# EAGLE design 8085v13 (EAGLE 6.1)
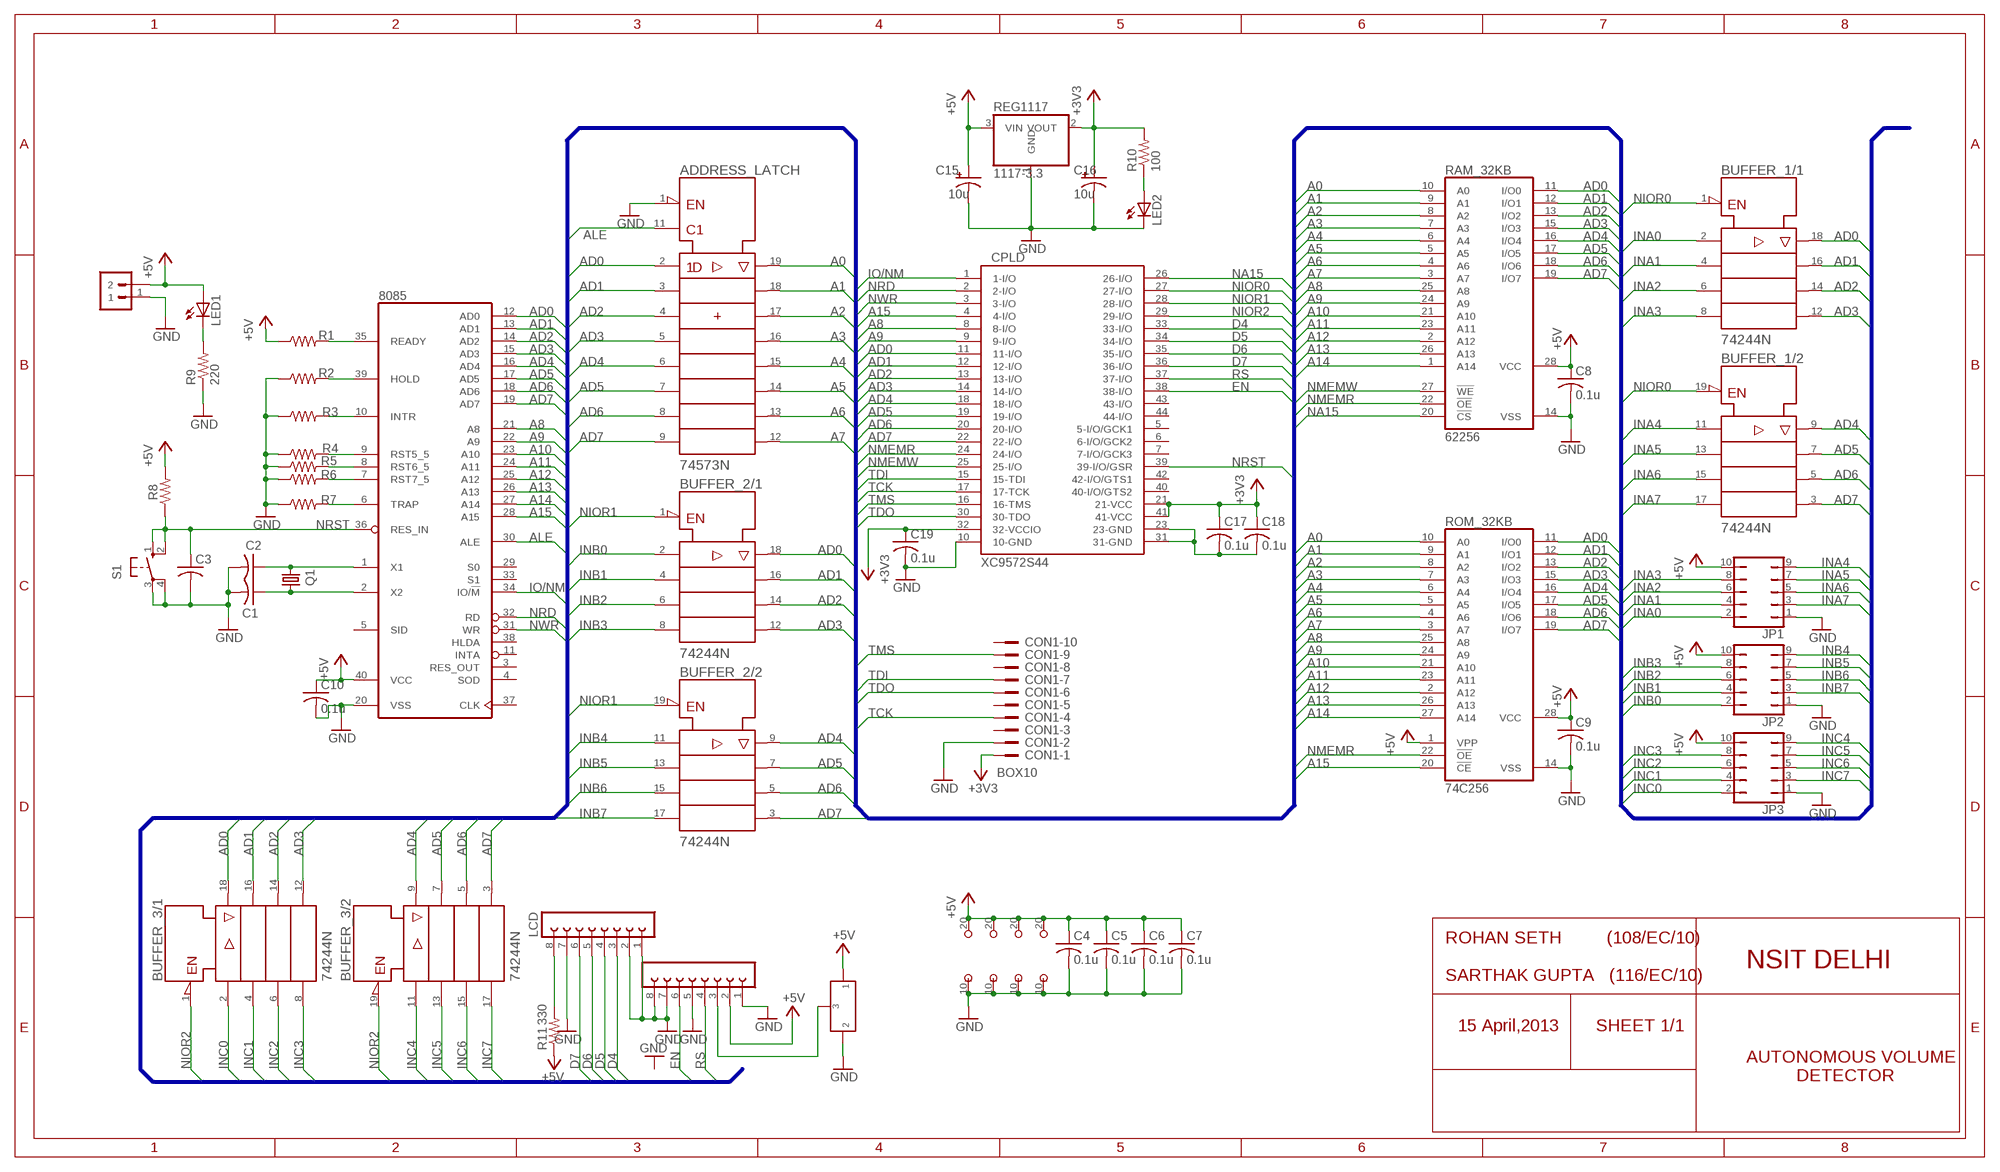
[diagram p0: schematic, sheet 1]

## Parts
1117-3.3  REG1117  [SOT223]
8085  8085  [DIL40]
ADDRESS_LATCH  74573N  [DIL20]
BUFFER_1  74244N  [DIL20]
BUFFER_2  74244N  [DIL20]
BUFFER_3  74244N  [DIL20]
C1  C-US025-030X050  [C025-030X050]
C2  C-US025-030X050  [C025-030X050]
C3  C-US025-030X050  [C025-030X050]
C4  0.1u  C-US025-030X050  [C025-030X050]
C5  0.1u  C-US025-030X050  [C025-030X050]
C6  0.1u  C-US025-030X050  [C025-030X050]
C7  0.1u  C-US025-030X050  [C025-030X050]
C8  0.1u  C-US025-030X050  [C025-030X050]
C9  0.1u  C-US025-030X050  [C025-030X050]
C10  0.1u  C-US025-030X050  [C025-030X050]
C15  10u  CPOL-USE2.5-5  [E2,5-5]
C16  10u  CPOL-USE2.5-5  [E2,5-5]
C17  0.1u  C-US025-030X050  [C025-030X050]
C18  0.1u  C-US025-030X050  [C025-030X050]
C19  0.1u  C-US025-030X050  [C025-030X050]
CON1  BOX10  [BOX10]
CPLD  XC9572S44  [PLCC-S44]
JP1  JP5Q  [JP5Q]
JP2  JP5Q  [JP5Q]
JP3  JP5Q  [JP5Q]
LCD  FE08-1  [FE08]
LED1  LED3MM  [LED3MM]
LED2  LED3MM  [LED3MM]
Q1  CRYSTALHC49US  [HC49US]
R1  R-US_0207/10  [0207/10]
R2  R-US_0207/10  [0207/10]
R3  R-US_0207/10  [0207/10]
R4  R-US_0207/10  [0207/10]
R5  R-US_0207/10  [0207/10]
R6  R-US_0207/10  [0207/10]
R7  R-US_0207/10  [0207/10]
R8  R-US_0207/10  [0207/10]
R9  220  RESISTOR0207/10  [0207/10]
R10  100  RESISTOR0207/10  [0207/10]
R11  330  R-US_0207/10  [0207/10]
RAM_32KB  62256  62256P  [DIL28-6]
ROM_32KB  74C256  27C256AG  [DIL28-6]
S1  10-XX  [B3F-10XX]
SV2  FE08-1  [FE08]
U$1  PRESET_LR  [PRESET_LR]
U$2  1X2_LR  [1X2_LR]

## Nets
+3V3 [power]: 1117-3.3.2(VOUT) C16.+ C17.1 C18.1 C19.1 CON1.1 CPLD.21(21-VCC) CPLD.32(32-VCCIO) CPLD.41(41-VCC) R10.2
+5V [power]: 1117-3.3.3(VIN) 8085.40(VCC) ADDRESS_LATCH.20(+UB) BUFFER_1.20(/+UB:+UB) BUFFER_2.20(/+UB:+UB) BUFFER_3.20(/+UB:+UB) C4.1 C5.1 C6.1 C7.1 C8.1 C9.1 C10.1 C15.+ JP1.10 JP2.10 JP3.10 LED1.A R1.1 R8.2 R11.1 RAM_32KB.28(VCC) ROM_32KB.1(VPP) ROM_32KB.28(VCC) SV2.2 U$1.P$1 U$2.2
A0: ADDRESS_LATCH.19(1Q) RAM_32KB.10(A0) ROM_32KB.10(A0)
A1: ADDRESS_LATCH.18(2Q) RAM_32KB.9(A1) ROM_32KB.9(A1)
A2: ADDRESS_LATCH.17(3Q) RAM_32KB.8(A2) ROM_32KB.8(A2)
A3: ADDRESS_LATCH.16(4Q) RAM_32KB.7(A3) ROM_32KB.7(A3)
A4: ADDRESS_LATCH.15(5Q) RAM_32KB.6(A4) ROM_32KB.6(A4)
A5: ADDRESS_LATCH.14(6Q) RAM_32KB.5(A5) ROM_32KB.5(A5)
A6: ADDRESS_LATCH.13(7Q) RAM_32KB.4(A6) ROM_32KB.4(A6)
A7 [smd]: ADDRESS_LATCH.12(8Q) RAM_32KB.3(A7) ROM_32KB.3(A7)
A8: 8085.21(A8) CPLD.8(8-I/O) RAM_32KB.25(A8) ROM_32KB.25(A8)
A9: 8085.22(A9) CPLD.9(9-I/O) RAM_32KB.24(A9) ROM_32KB.24(A9)
A10: 8085.23(A10) RAM_32KB.21(A10) ROM_32KB.21(A10)
A11: 8085.24(A11) RAM_32KB.23(A11) ROM_32KB.23(A11)
A12: 8085.25(A12) RAM_32KB.2(A12) ROM_32KB.2(A12)
A13: 8085.26(A13) RAM_32KB.26(A13) ROM_32KB.26(A13)
A14: 8085.27(A14) RAM_32KB.1(A14) ROM_32KB.27(A14)
A15 [smd]: 8085.28(A15) CPLD.4(4-I/O) ROM_32KB.20(!CE)
AD0 [smd]: 8085.12(AD0) ADDRESS_LATCH.2(1D) BUFFER_1.18(/1:Y1) BUFFER_2.18(/1:Y1) BUFFER_3.18(/1:Y1) CPLD.11(11-I/O) RAM_32KB.11(I/O0) ROM_32KB.11(I/O0)
AD1 [smd]: 8085.13(AD1) ADDRESS_LATCH.3(2D) BUFFER_1.16(/1:Y2) BUFFER_2.16(/1:Y2) BUFFER_3.16(/1:Y2) CPLD.12(12-I/O) RAM_32KB.12(I/O1) ROM_32KB.12(I/O1)
AD2: 8085.14(AD2) ADDRESS_LATCH.4(3D) BUFFER_1.14(/1:Y3) BUFFER_2.14(/1:Y3) BUFFER_3.14(/1:Y3) CPLD.13(13-I/O) RAM_32KB.13(I/O2) ROM_32KB.13(I/O2)
AD3 [smd]: 8085.15(AD3) ADDRESS_LATCH.5(4D) BUFFER_1.12(/1:Y4) BUFFER_2.12(/1:Y4) BUFFER_3.12(/1:Y4) CPLD.14(14-I/O) RAM_32KB.15(I/O3) ROM_32KB.15(I/O3)
AD4: 8085.16(AD4) ADDRESS_LATCH.6(5D) BUFFER_1.9(/2:Y1) BUFFER_2.9(/2:Y1) BUFFER_3.9(/2:Y1) CPLD.18(18-I/O) RAM_32KB.16(I/O4) ROM_32KB.16(I/O4)
AD5: 8085.17(AD5) ADDRESS_LATCH.7(6D) BUFFER_1.7(/2:Y2) BUFFER_2.7(/2:Y2) BUFFER_3.7(/2:Y2) CPLD.19(19-I/O) RAM_32KB.17(I/O5) ROM_32KB.17(I/O5)
AD6: 8085.18(AD6) ADDRESS_LATCH.8(7D) BUFFER_1.5(/2:Y3) BUFFER_2.5(/2:Y3) BUFFER_3.5(/2:Y3) CPLD.20(20-I/O) RAM_32KB.18(I/O6) ROM_32KB.18(I/O6)
AD7: 8085.19(AD7) ADDRESS_LATCH.9(8D) BUFFER_1.3(/2:Y4) BUFFER_2.3(/2:Y4) BUFFER_3.3(/2:Y4) CPLD.22(22-I/O) RAM_32KB.19(I/O7) ROM_32KB.19(I/O7)
ALE: 8085.30(ALE) ADDRESS_LATCH.11(C)
D4: CPLD.33(33-I/O) LCD.3
D5 [smd]: CPLD.34(34-I/O) LCD.4
D6: CPLD.35(35-I/O) LCD.5
D7 [smd]: CPLD.36(36-I/O) LCD.6
EN [smd]: CPLD.38(38-I/O) SV2.6
GND [power]: 1117-3.3.1(GND) 8085.20(VSS) ADDRESS_LATCH.1(!OC) ADDRESS_LATCH.10(-UB) BUFFER_1.10(/-UB:-UB) BUFFER_2.10(/-UB:-UB) BUFFER_3.10(/-UB:-UB) C1.2 C2.2 C3.2 C4.2 C5.2 C6.2 C7.2 C8.2 C9.2 C10.2 C15.- C16.- C19.2 CON1.2 CPLD.10(10-GND) JP1.1 JP2.1 JP3.1 LCD.1 LCD.2 LCD.7 LED2.K(C) R2.1 R3.1 R4.1 R5.1 R6.1 R7.1 R9.1 RAM_32KB.14(VSS) ROM_32KB.14(VSS) S1.3(P) S1.4(P1) SV2.1 SV2.5 SV2.7 SV2.8 U$1.P$2 U$2.1
INA0: BUFFER_1.2(/1:A1) JP1.2
INA1: BUFFER_1.4(/1:A2) JP1.4
INA2: BUFFER_1.6(/1:A3) JP1.6
INA3: BUFFER_1.8(/1:A4) JP1.8
INA4: BUFFER_1.11(/2:A1) JP1.9
INA5: BUFFER_1.13(/2:A2) JP1.7
INA6: BUFFER_1.15(/2:A3) JP1.5
INA7: BUFFER_1.17(/2:A4) JP1.3
INB0 [smd]: BUFFER_2.2(/1:A1) JP2.2
INB1: BUFFER_2.4(/1:A2) JP2.4
INB2: BUFFER_2.6(/1:A3) JP2.6
INB3: BUFFER_2.8(/1:A4) JP2.8
INB4 [smd]: BUFFER_2.11(/2:A1) JP2.9
INB5: BUFFER_2.13(/2:A2) JP2.7
INB6 [smd]: BUFFER_2.15(/2:A3) JP2.5
INB7 [smd]: BUFFER_2.17(/2:A4) JP2.3
INC0: BUFFER_3.2(/1:A1) JP3.2
INC1: BUFFER_3.4(/1:A2) JP3.4
INC2: BUFFER_3.6(/1:A3) JP3.6
INC3: BUFFER_3.8(/1:A4) JP3.8
INC4: BUFFER_3.11(/2:A1) JP3.9
INC5: BUFFER_3.13(/2:A2) JP3.7
INC6: BUFFER_3.15(/2:A3) JP3.5
INC7: BUFFER_3.17(/2:A4) JP3.3
IO/NM [smd]: 8085.34(IO/!M) CPLD.1(1-I/O)
N$1: 8085.1(X1) C2.1 Q1.2
N$2: 8085.2(X2) C1.1 Q1.1
N$3: 8085.35(READY) R1.2
N$4: 8085.39(HOLD) R2.2
N$5: 8085.10(INTR) R3.2
N$6: 8085.9(RST5_5) R4.2
N$7: 8085.8(RST6_5) R5.2
N$8: 8085.7(RST7_5) R6.2
N$9: 8085.6(TRAP) R7.2
N$12 [smd]: C17.2 C18.2 CPLD.23(23-GND) CPLD.31(31-GND)
N$15: LCD.8 R11.2
N$46: LED1.K(C) R9.2
N$47: SV2.3 U$1.P$3
N$51: LED2.A R10.1
NA15: CPLD.26(26-I/O) RAM_32KB.20(!CS)
NIOR0 [smd]: BUFFER_1.1(/1:!G) BUFFER_1.19(/2:!G) CPLD.27(27-I/O)
NIOR1 [smd]: BUFFER_2.1(/1:!G) BUFFER_2.19(/2:!G) CPLD.28(28-I/O)
NIOR2: BUFFER_3.1(/1:!G) BUFFER_3.19(/2:!G) CPLD.29(29-I/O)
NMEMR [smd]: CPLD.24(24-I/O) RAM_32KB.22(!OE) ROM_32KB.22(!OE)
NMEMW [smd]: CPLD.25(25-I/O) RAM_32KB.27(!WE)
NRD [smd]: 8085.32(RD) CPLD.2(2-I/O)
NRST: 8085.36(RES_IN) C3.1 CPLD.39(39-I/O/GSR) R8.1 S1.1(S) S1.2(S1)
NWR: 8085.31(WR) CPLD.3(3-I/O)
RS [smd]: CPLD.37(37-I/O) SV2.4
TCK: CON1.4 CPLD.17(17-TCK)
TDI: CON1.7 CPLD.15(15-TDI)
TDO [smd]: CON1.6 CPLD.30(30-TDO)
TMS [smd]: CON1.9 CPLD.16(16-TMS)
Unconnected: 8085.3(RES_OUT) 8085.4(SOD) 8085.5(SID) 8085.11(INTA) 8085.29(S0) 8085.33(S1) 8085.37(CLK) 8085.38(HLDA) CON1.3 CON1.5 CON1.8 CON1.10 CPLD.5(5-I/O/GCK1) CPLD.6(6-I/O/GCK2) CPLD.7(7-I/O/GCK3) CPLD.40(40-I/O/GTS2) CPLD.42(42-I/O/GTS1) CPLD.43(43-I/O) CPLD.44(44-I/O)

## Buses
AD[0..7],A[8..15],A[0..7],ALE,IO/NM,NRD,NWR,NMEMR,NMEMW,NIOR,NIOW,D[4..7],RS,EN,NIOR[0..2],NA15,TDI,TMS,TCK,TDO,INA[0..7],INB[0..7],INC[0..7],NRST

## Notes on the sheet
- NSIT DELHI
- ROHAN SETH         (108/EC/10)
  
  SARTHAK GUPTA   (116/EC/10)
- 15 April,2013 | SHEET 1/1
- AUTONOMOUS VOLUME
            DETECTOR

## Library data of the parts
1117-3.3 = CEDTv69:REG1117: 800mA and 1A Low Dropout (LDO) Positive Regulator 1.8V, 2.5V, 2.85V, 3.3V, 5V, and Adj
8085 = micro-intel:8085: MICROCOMPUTER/PERIPHERAL DEVICE
ADDRESS_LATCH = 74ttl-din:74*573: 8-bit D latch BUS DRIVER
BUFFER_1-BUFFER_3 = 74ttl-din:74*244: Octal BUFFER and LINE DRIVER, 3-state
C1-C10 C17-C19 = resistor:C-US: CAPACITOR, American symbol
C15 C16 = resistor:CPOL-US: POLARIZED CAPACITOR, American symbol
CON1 = CEDTv73:BOX10: 3M (TM) Pak 100 4-Wall Header Source: 3M
CPLD = CEDTv68:XC9572
JP1-JP3 = jumper:JP5Q: JUMPER
LCD SV2 = con-lsta:FE08-1: FEMALE HEADER; OC_FARNELL: unknown; OC_NEWARK: unknown
LED1 LED2 = CEDTv73:LED
Q1 = CEDTv69:CRYSTAL: Crystals Various standard crystals. Proven footprints. Spark Fun Electronics SKU : COM-00534
R1-R8 = resistor:R-US_: RESISTOR, American symbol
R9 R10 = CEDTv73:RESISTOR
R11 = rcl:R-US_: RESISTOR, American symbol
RAM_32KB = memory-hitachi:62256P: MEMORY
ROM_32KB = memory-hitachi:27C256AG: MEMORY
S1 = CEDTv69:10-XX: OMRON SWITCH
U$1 = CEDTv69:PRESET_LR
U$2 = CEDTv73:1X2_LR

## Net classes
0 default: width 0.305 mm, clearance 0.203 mm
1 power: width 0.61 mm, clearance 0.203 mm
2 smd: width 0.254 mm, clearance 0.203 mm

## Board
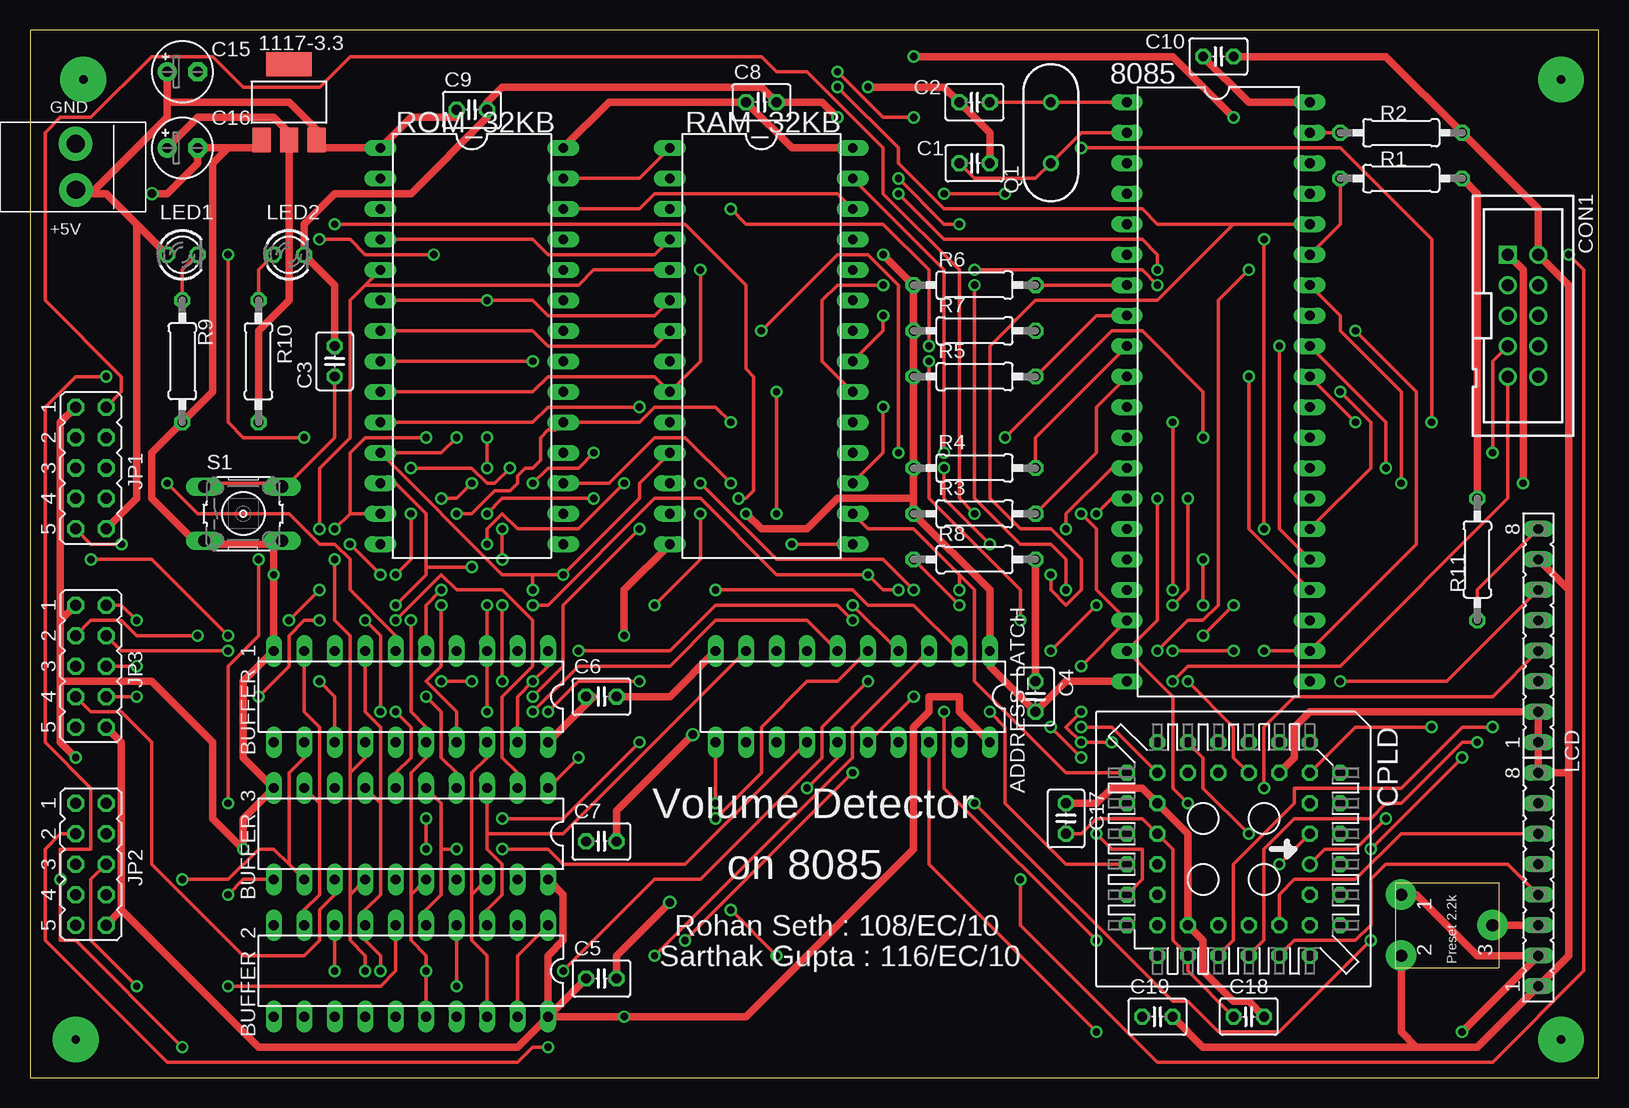
[diagram p1: board, top side]
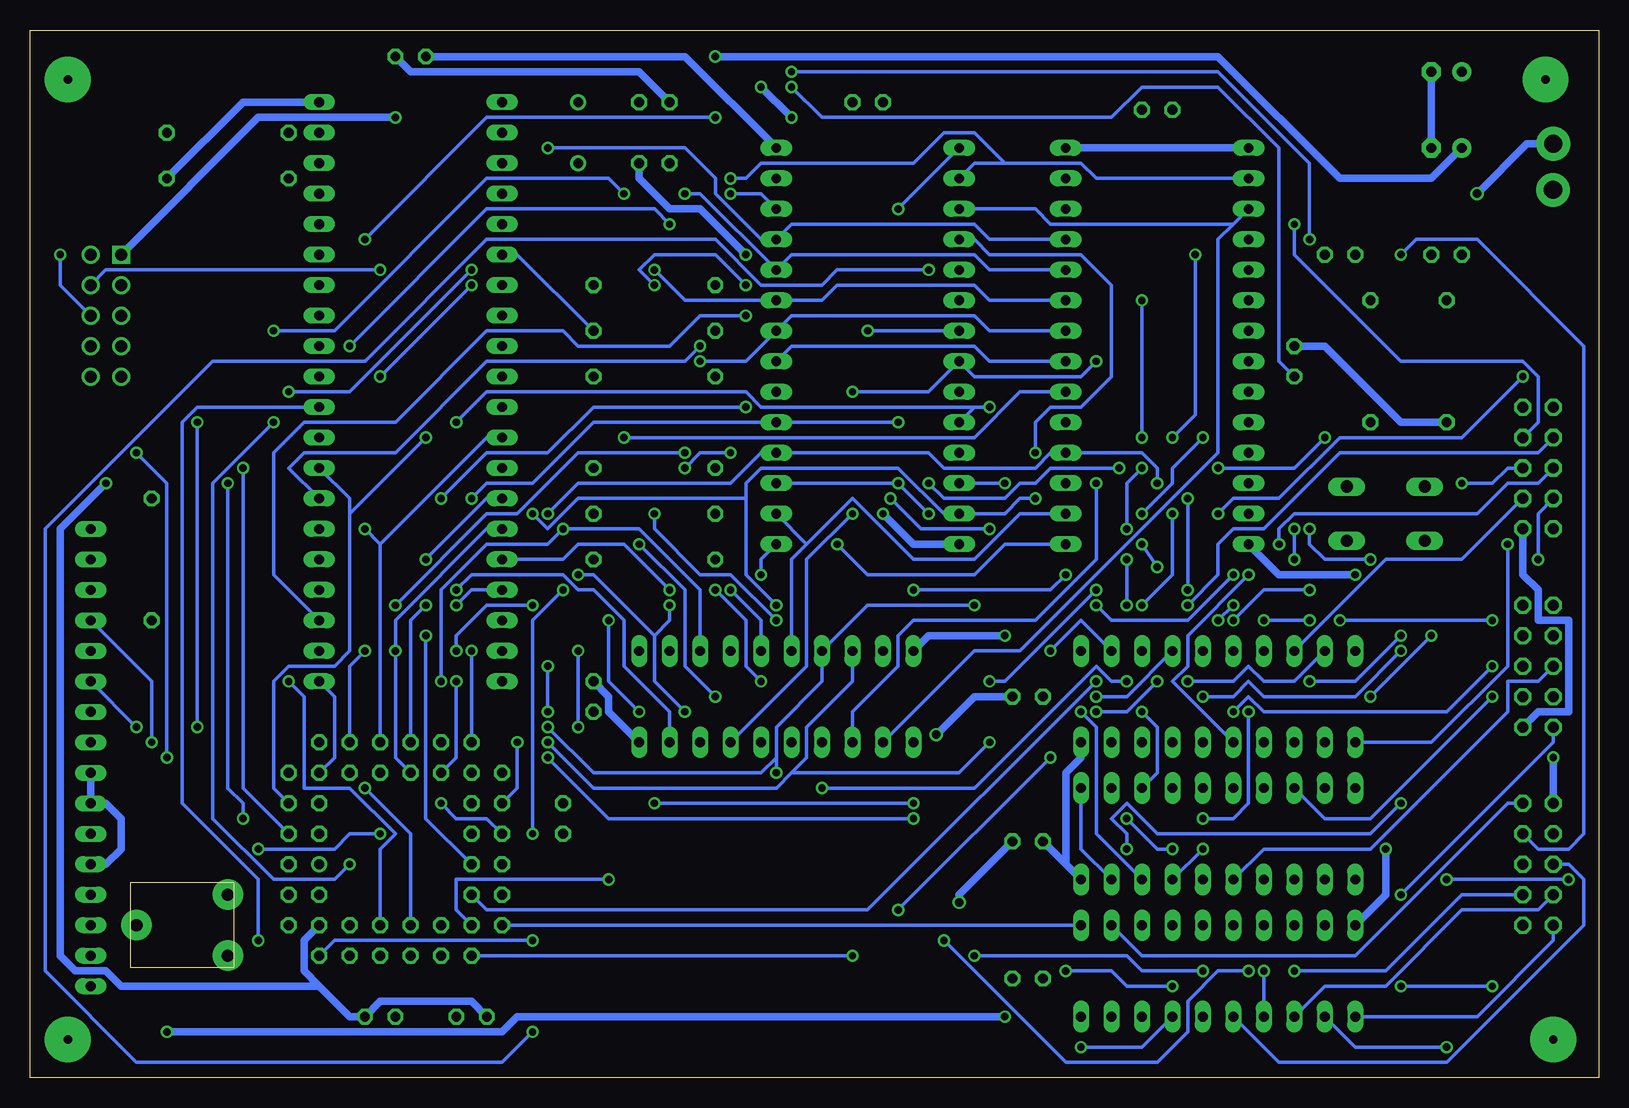
[diagram p2: board, bottom side, seen from below]

Size 130.79 x 87.3 mm. Coordinates in mm from the lower left corner, seen from the top.
Outline: 0,0 130.79,0 130.79,87.3 0,87.3 0,0
Copper layers (1*16): Top 0.035mm / dielectric 1.5mm / Bottom 0.035mm
Design rules: minimum track width 12mil, minimum drill 24mil, track to track 8mil, track to pad 8mil, pad to pad 8mil, via to via 8mil, smd to smd 8mil, copper to edge 40mil, drill to drill 8mil, minimum pad ring 10mil, minimum via ring 8mil, stop-mask expansion 4mil, vias tented up to drill 0mil, thermal gap 10mil

### Footprints (pad centres in the part's own frame; a part is rotated, then mirrored left to right if it is on the bottom)
SOT223 = smd 1.499 x 2.007: 1 -2.261,-3.15; 2 0.025,-3.15; 3 2.311,-3.15 | smd 3.81 x 2.007: 4 0,3.15
DIL40 = drill 0.813 long: 1 -24.13,-7.62; 2 -21.59,-7.62; 3 -19.05,-7.62; 4 -16.51,-7.62; 5 -13.97,-7.62; 6 -11.43,-7.62; 7 -8.89,-7.62; 8 -6.35,-7.62; 9 -3.81,-7.62; 10 -1.27,-7.62; 11 1.27,-7.62; 12 3.81,-7.62; 13 6.35,-7.62; 14 8.89,-7.62; 15 11.43,-7.62; 16 13.97,-7.62; 17 16.51,-7.62; 18 19.05,-7.62; 19 21.59,-7.62; 20 24.13,-7.62; 21 24.13,7.62; 22 21.59,7.62; 23 19.05,7.62; 24 16.51,7.62; 25 13.97,7.62; 26 11.43,7.62; 27 8.89,7.62; 28 6.35,7.62; 29 3.81,7.62; 30 1.27,7.62; 31 -1.27,7.62; 32 -3.81,7.62; 33 -6.35,7.62; 34 -8.89,7.62; 35 -11.43,7.62; 36 -13.97,7.62; 37 -16.51,7.62; 38 -19.05,7.62; 39 -21.59,7.62; 40 -24.13,7.62
DIL20 = drill 0.813 long: 1 -11.43,-3.81; 2 -8.89,-3.81; 3 -6.35,-3.81; 4 -3.81,-3.81; 5 -1.27,-3.81; 6 1.27,-3.81; 7 3.81,-3.81; 8 6.35,-3.81; 9 8.89,-3.81; 10 11.43,-3.81; 11 11.43,3.81; 12 8.89,3.81; 13 6.35,3.81; 14 3.81,3.81; 15 1.27,3.81; 16 -1.27,3.81; 17 -3.81,3.81; 18 -6.35,3.81; 19 -8.89,3.81; 20 -11.43,3.81
C025-030X050 = drill 0.813 octagon: 1 -1.27,0; 2 1.27,0
E2,5-5 = drill 0.813 pad 1.6: + -1.27,0 | drill 0.813 pad 1.6 octagon: - 1.27,0
BOX10 = drill 1 pad 1.422 square: 1 -5.08,-1.27 | drill 1 pad 1.422: 2 -5.08,1.27; 3 -2.54,-1.27; 4 -2.54,1.27; 5 0,-1.27; 6 0,1.27; 7 2.54,-1.27; 8 2.54,1.27; 9 5.08,-1.27; 10 5.08,1.27
PLCC-S44 = drill 0.813: 1 1.27,6.35 | drill 0.813 octagon: 2 -1.27,8.89; 3 -1.27,6.35; 4 -3.81,8.89; 5 -3.81,6.35; 6 -6.35,8.89; 7 -8.89,6.35; 8 -6.35,6.35; 9 -8.89,3.81; 10 -6.35,3.81; 11 -8.89,1.27; 12 -6.35,1.27; 13 -8.89,-1.27; 14 -6.35,-1.27; 15 -8.89,-3.81; 16 -6.35,-3.81; 17 -8.89,-6.35; 18 -6.35,-8.89; 19 -6.35,-6.35; 20 -3.81,-8.89; 21 -3.81,-6.35; 22 -1.27,-8.89; 23 -1.27,-6.35; 24 1.27,-8.89; 25 1.27,-6.35; 26 3.81,-8.89; 27 3.81,-6.35; 28 6.35,-8.89; 29 8.89,-6.35; 30 6.35,-6.35; 31 8.89,-3.81; 32 6.35,-3.81; 33 8.89,-1.27; 34 6.35,-1.27; 35 8.89,1.27; 36 6.35,1.27; 37 8.89,3.81; 38 6.35,3.81; 39 8.89,6.35; 40 6.35,8.89; 41 6.35,6.35; 42 3.81,8.89; 43 3.81,6.35; 44 1.27,8.89
JP5Q = drill 0.914 octagon: 1 -5.08,-1.27; 2 -5.08,1.27; 3 -2.54,-1.27; 4 -2.54,1.27; 5 0,-1.27; 6 0,1.27; 7 2.54,-1.27; 8 2.54,1.27; 9 5.08,-1.27; 10 5.08,1.27
FE08 = drill 0.813 long: 1 -8.89,0; 2 -6.35,0; 3 -3.81,0; 4 -1.27,0; 5 1.27,0; 6 3.81,0; 7 6.35,0; 8 8.89,0
LED3MM = drill 0.813 octagon: A -1.27,0; K 1.27,0
HC49US = drill 0.813: 1 -2.54,0; 2 2.54,0
0207/10 = drill 0.813 octagon: 1 -5.08,0; 2 5.08,0
DIL28-6 = drill 0.813 long: 1 -16.51,-7.62; 2 -13.97,-7.62; 3 -11.43,-7.62; 4 -8.89,-7.62; 5 -6.35,-7.62; 6 -3.81,-7.62; 7 -1.27,-7.62; 8 1.27,-7.62; 9 3.81,-7.62; 10 6.35,-7.62; 11 8.89,-7.62; 12 11.43,-7.62; 13 13.97,-7.62; 14 16.51,-7.62; 15 16.51,7.62; 16 13.97,7.62; 17 11.43,7.62; 18 8.89,7.62; 19 6.35,7.62; 20 3.81,7.62; 21 1.27,7.62; 22 -1.27,7.62; 23 -3.81,7.62; 24 -6.35,7.62; 25 -8.89,7.62; 26 -11.43,7.62; 27 -13.97,7.62; 28 -16.51,7.62
B3F-10XX = drill 1.016 long: 1 -3.251,2.261; 2 3.251,2.261; 3 -3.251,-2.261; 4 3.251,-2.261
PRESET_LR = drill 1.016 pad 2.54: P$1 -2.54,-3.81; P$2 2.54,-3.81; P$3 0,3.81
1X2_LR = drill 1.524 pad 2.794: 1 -1.621,3.81; 2 2.218,3.83; 3 -1.621,3.81

### Placement (x,y rotation side)
1117-3.3  21.59,81.28 0 top
8085  99.06,57.15 270 top
ADDRESS_LATCH  68.58,31.75 180 top
BUFFER_1  31.75,31.75 180 top
BUFFER_2  31.75,8.89 180 top
BUFFER_3  31.75,20.32 180 top
C1  78.74,76.2 0 top
C2  78.74,81.28 180 top
C3  25.4,59.69 90 top
C4  83.82,31.75 270 top
C5  47.62,8.26 0 top
C6  47.62,31.75 0 top
C7  47.62,19.68 0 top
C8  60.96,81.28 0 top
C9  36.83,80.64 0 top
C10  99.06,85.09 0 top
C15  12.7,83.82 0 top
C16  12.7,77.47 0 top
C17  86.36,21.59 270 top
C18  101.6,5.08 180 top
C19  93.98,5.08 0 top
CON1  124.46,63.5 270 top
CPLD  100.33,19.05 270 top
JP1  5.08,50.8 270 top
JP2  5.08,17.78 270 top
JP3  5.08,34.29 270 top
LCD  125.73,36.83 90 top
LED1  12.7,68.58 0 top
LED2  21.59,68.58 0 top
Q1  85.09,78.74 90 top
R1  114.3,74.93 180 top
R2  114.3,78.74 180 top
R3  78.74,46.99 0 top
R4  78.74,50.8 0 top
R5  78.74,58.42 0 top
R6  78.74,66.04 0 top
R7  78.74,62.23 0 top
R8  78.74,43.18 0 top
R9  12.7,59.69 90 top
R10  19.05,59.69 270 top
R11  120.65,43.18 270 top
RAM_32KB  60.96,60.96 270 top
ROM_32KB  36.83,60.96 270 top
S1  17.78,46.99 0 top
SV2  125.73,16.51 90 top
U$1  118.11,12.7 270 top
U$2  0,76.2 270 top

### Tracks (layer width: path | path; a pad name or v marks a point on that pad's centre or on a via)
+3V3  (via drill 0.61)
  Top 0.61: C16.+ 13.97,80.01 20.32,80.01 21.59,78.74 1117-3.3.2 21.59,77.47 21.59,64.77 19.05,62.23 R10.2 | C17.1 88.9,22.86 90.17,24.13 92.71,24.13 CPLD.21 96.52,20.32 CPLD.32 97.79,11.43 97.79,8.89 100.33,6.35 101.6,6.35 C18.1 | CON1.1 124.46,67.31 v124.46,49.53 | v73.66,85.09 95.25,85.09 v100.33,80.01
  Bottom 0.61: C19.1 93.98,6.35 101.6,6.35 C18.1 104.14,5.08 106.68,7.62 | CPLD.41 107.95,11.43 107.95,8.89 106.68,7.62 | v124.46,49.53 128.27,45.72 128.27,10.16 127,8.89 124.46,8.89 123.19,7.62 106.68,7.62 | C16.+ 13.97,74.93 21.59,74.93 31.75,85.09 v73.66,85.09 | v100.33,80.01 111.76,80.01 CON1.1
+5V  (via drill 0.61)
  Top 0.61: C4.1 R8.2 | 7.62,13.97 JP2.10 | 7.62,13.97 7.62,27.94 JP3.10 | BUFFER_1.20 46.99,31.75 C6.1 | BUFFER_2.20 43.18,10.16 44.45,11.43 44.45,15.24 BUFFER_3.20 | v119.38,3.81 SV2.2 120.65,10.16 115.57,15.24 U$1.P$1 | BUFFER_2.20 v49.53,5.08 59.69,5.08 73.66,19.05 73.66,29.21 74.93,30.48 74.93,31.75 77.47,31.75 77.47,30.48 ADDRESS_LATCH.20 | 7.62,13.97 19.05,2.54 40.64,2.54 BUFFER_2.20 | 8085.40 101.6,81.28 C10.1 | R11.1 120.65,73.66 R1.1 | RAM_32KB.28 63.5,77.47 C8.1 48.26,81.28 ROM_32KB.28 | C9.1 35.56,80.01 31.75,80.01 ROM_32KB.1 24.13,77.47 1117-3.3.3 24.13,78.74 21.59,81.28 11.43,81.28 | 8.89,71.12 6.35,73.66 5.08,73.66 | 8.89,71.12 LED1.A | JP1.10 8.89,48.26 8.89,71.12 | 11.43,81.28 11.43,80.01 5.08,73.66 | 11.43,81.28 C15.+ | 5.08,73.66 U$2.2 | C5.1 BUFFER_2.20
  Bottom 0.61: ADDRESS_LATCH.20 82.55,30.48 82.55,31.75 C4.1 | v119.38,3.81 91.44,3.81 90.17,5.08 v49.53,5.08 | BUFFER_1.20 43.18,26.67 44.45,25.4 44.45,17.78 | BUFFER_3.20 44.45,17.78 | R1.1 113.03,81.28 8085.40 | ROM_32KB.1 ROM_32KB.28 | C10.1 76.2,85.09 RAM_32KB.28 | JP3.10 5.08,30.48 2.54,30.48 2.54,38.1 5.08,38.1 5.08,40.64 6.35,41.91 JP1.10 | C7.1 44.45,17.78
A0  (via drill 0.61)
  Top 0.305: ROM_32KB.10 41.91,54.61 43.18,55.88 v50.8,55.88 | v95.25,54.61 v95.25,40.64
  Bottom 0.305: 52.07,55.88 v50.8,55.88 | RAM_32KB.10 52.07,55.88 | ADDRESS_LATCH.19 77.47,30.48 81.28,34.29 81.28,38.1 83.82,40.64 85.09,40.64 86.36,41.91 93.98,41.91 v95.25,40.64 | v95.25,54.61 92.71,57.15 71.12,57.15 69.85,55.88 52.07,55.88
A1  (via drill 0.61)
  Top 0.305: ROM_32KB.9 41.91,57.15 43.18,58.42 52.07,58.42 RAM_32KB.9 55.88,59.69 v55.88,67.31 | ADDRESS_LATCH.18 74.93,17.78 v88.9,3.81
  Bottom 0.305: v88.9,3.81 91.44,1.27 121.92,1.27 129.54,8.89 129.54,45.72 115.57,59.69 102.87,59.69 92.71,69.85 73.66,69.85 69.85,66.04 64.77,66.04 63.5,67.31 v55.88,67.31
A2  (via drill 0.61)
  Top 0.305: v41.91,59.69 ROM_32KB.8 | v62.23,57.15 v62.23,46.99
  Bottom 0.305: v41.91,59.69 43.18,58.42 52.07,58.42 RAM_32KB.8 55.88,57.15 v62.23,57.15 | ADDRESS_LATCH.17 66.04,34.29 66.04,43.18 v62.23,46.99
A3  (via drill 0.61)
  Top 0.305: ROM_32KB.7 41.91,62.23 43.18,60.96 52.07,60.96 RAM_32KB.7 | v73.66,31.75 ADDRESS_LATCH.16 | v80.01,44.45 76.2,48.26 v76.2,50.8 | v72.39,52.07 72.39,66.04 69.85,68.58 67.31,68.58 v60.96,62.23
  Bottom 0.305: v73.66,31.75 76.2,34.29 76.2,40.64 v80.01,44.45 | v76.2,50.8 74.93,52.07 v72.39,52.07 | RAM_32KB.7 v60.96,62.23
A4  (via drill 0.61)
  Top 0.305: ROM_32KB.6 v38.1,64.77 41.91,64.77 43.18,63.5 52.07,63.5 RAM_32KB.6 | ADDRESS_LATCH.15 67.31,26.67 v64.77,24.13 | v39.37,39.37 v39.37,33.02 | v39.37,45.72 v39.37,43.18 | v38.1,53.34 v38.1,50.8
  Bottom 0.305: v64.77,24.13 52.07,24.13 41.91,34.29 40.64,33.02 v39.37,33.02 | v39.37,43.18 v39.37,39.37 | v39.37,45.72 39.37,49.53 v38.1,50.8 | v38.1,64.77 v38.1,53.34
A5  (via drill 0.61)
  Top 0.305: ADDRESS_LATCH.14 54.61,17.78 44.45,17.78 43.18,19.05 v39.37,19.05 | v16.51,22.86 16.51,34.29 19.05,36.83 v19.05,43.18 | v24.13,45.72 24.13,50.8 26.67,53.34 26.67,64.77 27.94,66.04 | ROM_32KB.5 27.94,66.04 | RAM_32KB.5 46.99,67.31 45.72,66.04 27.94,66.04
  Bottom 0.305: v39.37,19.05 39.37,20.32 40.64,21.59 39.37,22.86 36.83,20.32 19.05,20.32 v16.51,22.86 | v19.05,43.18 22.86,43.18 24.13,44.45 v24.13,45.72
A6  (via drill 0.61)
  Top 0.305: ROM_32KB.4 41.91,69.85 43.18,68.58 52.07,68.58 RAM_32KB.4 | v41.91,49.53 43.18,50.8 45.72,50.8 v46.99,52.07
  Bottom 0.305: ADDRESS_LATCH.13 62.23,30.48 58.42,34.29 58.42,36.83 57.15,38.1 46.99,38.1 41.91,43.18 v41.91,49.53 | v46.99,52.07 46.99,54.61 45.72,55.88 43.18,55.88 40.64,58.42 40.64,66.04 43.18,68.58 50.8,68.58 52.07,69.85 RAM_32KB.4
A7
  Bottom 0.305: ADDRESS_LATCH.12 52.07,35.56 48.26,35.56 31.75,52.07 31.75,69.85 30.48,71.12 | ROM_32KB.3 30.48,71.12 | RAM_32KB.3 46.99,72.39 45.72,71.12 30.48,71.12
A8  (via drill 0.61)
  Top 0.305: CPLD.8 110.49,29.21 v116.84,29.21 | v116.84,54.61 116.84,69.85 109.22,77.47 v87.63,77.47
  Bottom 0.305: CPLD.8 105.41,26.67 105.41,31.75 8085.21 | ROM_32KB.25 50.8,69.85 52.07,71.12 67.31,71.12 RAM_32KB.25 69.85,69.85 73.66,73.66 73.66,74.93 76.2,77.47 v87.63,77.47 | v116.84,54.61 v116.84,29.21
A9  (via drill 0.61)
  Top 0.305: v102.87,35.56 8085.22 115.57,44.45 115.57,57.15 v110.49,62.23 | v76.2,73.66 v81.28,73.66
  Bottom 0.305: CPLD.9 104.14,34.29 v102.87,35.56 | ROM_32KB.24 50.8,67.31 52.07,68.58 67.31,68.58 RAM_32KB.24 74.93,73.66 v76.2,73.66 | v110.49,62.23 105.41,62.23 92.71,74.93 82.55,74.93 v81.28,73.66
A10  (via drill 0.61)
  Top 0.305: v71.12,63.5 71.12,62.23 RAM_32KB.21
  Bottom 0.305: ROM_32KB.21 50.8,59.69 52.07,60.96 67.31,60.96 RAM_32KB.21 | 8085.23 110.49,41.91 110.49,52.07 107.95,54.61 100.33,54.61 92.71,62.23 86.36,62.23 85.09,60.96 77.47,60.96 74.93,63.5 v71.12,63.5
A11  (via drill 0.61)
  Top 0.305: 8085.24 101.6,45.72 v101.6,58.42 | v93.98,66.04 92.71,67.31 v78.74,67.31
  Bottom 0.305: ROM_32KB.23 50.8,64.77 52.07,66.04 63.5,66.04 64.77,64.77 RAM_32KB.23 76.2,64.77 v78.74,67.31 | v93.98,66.04 v101.6,58.42
A12  (via drill 0.61)
  Top 0.305: 8085.25 104.14,45.72 v104.14,60.96 | v77.47,71.12 76.2,71.12 v72.39,74.93
  Bottom 0.305: ROM_32KB.2 41.91,74.93 43.18,76.2 49.53,76.2 | 49.53,76.2 52.07,76.2 RAM_32KB.2 | v104.14,60.96 92.71,72.39 78.74,72.39 v77.47,71.12 | v72.39,74.93 71.12,74.93 69.85,76.2 57.15,76.2 54.61,78.74 52.07,78.74 49.53,76.2
A13  (via drill 0.61)
  Top 0.305: ROM_32KB.26 50.8,72.39 52.07,73.66 67.31,73.66 RAM_32KB.26 | 8085.26 111.76,50.8 111.76,54.61 v109.22,57.15 | v93.98,67.31 93.98,68.58 92.71,69.85 76.2,69.85 v72.39,73.66
  Bottom 0.305: v109.22,57.15 104.14,57.15 v93.98,67.31 | v72.39,73.66 69.85,73.66 RAM_32KB.26
A14  (via drill 0.61)
  Top 0.305: ROM_32KB.27 50.8,74.93 RAM_32KB.1 | v74.93,60.96 74.93,67.31 71.12,71.12 59.69,71.12 v58.42,72.39
  Bottom 0.305: 8085.27 109.22,50.8 107.95,52.07 100.33,52.07 92.71,59.69 76.2,59.69 v74.93,60.96 | RAM_32KB.1 v58.42,72.39
A15  (via drill 0.61)
  Top 0.305: v81.28,53.34 90.17,62.23 92.71,62.23 97.79,57.15 v97.79,53.34
  Bottom 0.305: 8085.28 104.14,48.26 104.14,46.99 | 104.14,46.99 104.14,35.56 105.41,34.29 109.22,34.29 110.49,33.02 110.49,24.13 CPLD.4 | ROM_32KB.20 48.26,57.15 52.07,53.34 v81.28,53.34 | 104.14,46.99 v97.79,53.34
AD0  (via drill 0.61)
  Top 0.305: BUFFER_2.18 38.1,10.16 36.83,11.43 36.83,15.24 | BUFFER_3.18 36.83,15.24 | BUFFER_1.18 38.1,26.67 36.83,25.4 36.83,15.24 | 41.91,41.91 v44.45,41.91 50.8,48.26 50.8,49.53 RAM_32KB.11 | 41.91,41.91 39.37,41.91 ROM_32KB.11 34.29,52.07 v35.56,53.34 | ADDRESS_LATCH.2 73.66,39.37 69.85,39.37 68.58,40.64 v57.15,40.64 | v43.18,30.48 45.72,33.02 v50.8,33.02 | 41.91,41.91 v41.91,40.64 | v102.87,69.85 v102.87,45.72 | v73.66,80.01 71.12,80.01 v67.31,83.82 | v24.13,69.85 26.67,69.85 27.94,68.58 v33.66,68.58
  Bottom 0.305: 101.6,44.45 CPLD.11 | 101.6,44.45 92.71,53.34 8085.12 | v57.15,40.64 45.72,40.64 v44.45,41.91 | BUFFER_3.18 41.91,20.32 41.91,29.21 v43.18,30.48 | v50.8,33.02 49.53,33.02 v41.91,40.64 | v102.87,45.72 101.6,44.45 | v102.87,69.85 92.71,80.01 v73.66,80.01 | v67.31,83.82 31.75,83.82 24.13,76.2 v24.13,69.85 | v33.66,68.58 33.66,55.24 v35.56,53.34
AD1  (via drill 0.61)
  Top 0.305: v86.36,45.72 86.36,46.99 90.17,50.8 8085.13 | CPLD.12 100.33,26.67 100.33,29.21 v96.52,33.02 | BUFFER_2.16 v33.02,8.89 33.02,10.16 31.75,11.43 31.75,15.24 | BUFFER_3.16 31.75,15.24 | 31.75,15.24 31.75,25.4 33.02,26.67 BUFFER_1.16 33.02,29.21 31.75,30.48 v31.75,38.1 | ROM_32KB.12 30.48,49.53 33.02,46.99 33.02,42.55 | 33.02,42.55 33.02,41.91 v30.48,39.37 | v49.53,49.53 45.72,45.72 40.64,45.72 39.37,46.99 38.1,45.72 v38.1,44.45 | 33.02,42.55 v36.83,42.55 | ADDRESS_LATCH.3 68.58,29.21 68.58,26.67 v52.07,10.16
  Bottom 0.305: ADDRESS_LATCH.3 74.93,40.64 80.01,45.72 v86.36,45.72 87.63,44.45 92.71,44.45 96.52,40.64 v96.52,33.02 | v31.75,38.1 v30.48,39.37 | v49.53,49.53 RAM_32KB.12 | v36.83,42.55 v38.1,44.45 | v52.07,10.16 39.37,10.16 38.1,8.89 v33.02,8.89
AD2  (via drill 0.61)
  Top 0.305: v27.94,8.89 27.94,10.16 26.67,11.43 26.67,15.24 | BUFFER_3.14 26.67,15.24 | BUFFER_1.14 27.94,26.67 26.67,25.4 | 26.67,15.24 26.67,25.4 | 26.67,46.99 ROM_32KB.13 | v25.4,45.72 26.67,46.99 | v25.4,43.18 25.4,38.1 26.67,36.83 26.67,25.4 | ADDRESS_LATCH.4 v68.58,39.37 | 8085.14 90.17,48.26 v88.9,46.99 | v97.79,43.18 v97.79,39.37 | 26.67,46.99 26.67,52.07 27.94,53.34 v33.02,53.34 | v38.1,46.99 39.37,48.26 v46.99,48.26
  Bottom 0.305: v27.94,8.89 BUFFER_2.14 | v25.4,43.18 v25.4,45.72 | 71.12,48.26 71.12,41.91 v68.58,39.37 | 71.12,48.26 71.12,49.53 69.85,50.8 58.42,50.8 54.61,46.99 RAM_32KB.13 49.53,46.99 48.26,48.26 v46.99,48.26 | v88.9,46.99 87.63,45.72 85.09,48.26 71.12,48.26 | CPLD.13 99.06,38.1 v97.79,39.37 | v97.79,43.18 92.71,48.26 8085.14 | v33.02,53.34 35.56,50.8 35.56,49.53 v38.1,46.99
AD3  (via drill 0.61)
  Top 0.305: v12.7,2.54 3.81,11.43 2.54,11.43 v2.54,16.51 2.54,19.05 5.08,19.05 5.08,24.13 1.27,27.94 1.27,55.88 3.81,58.42 v6.35,58.42 | v12.7,16.51 16.51,16.51 19.05,19.05 20.32,19.05 21.59,17.78 | BUFFER_3.12 21.59,17.78 | BUFFER_1.12 22.86,26.67 21.59,25.4 21.59,17.78 | RAM_32KB.15 v63.5,44.45 | v72.39,40.64 71.12,40.64 v69.85,41.91 62.23,41.91 55.88,48.26 52.07,48.26 43.18,39.37 v41.91,39.37 | v95.25,35.56 v100.33,35.56 | v85.09,35.56 v88.9,39.37 | v87.63,26.67 v85.09,29.21 | v57.15,21.59 60.96,25.4 60.96,29.21 64.77,33.02 67.31,33.02 ADDRESS_LATCH.5 | v31.75,46.99 31.75,43.18 v30.48,41.91
  Bottom 0.305: BUFFER_2.12 20.32,2.54 v12.7,2.54 | v12.7,16.51 v2.54,16.51 | 8085.15 92.71,45.72 100.33,38.1 v100.33,35.56 100.33,26.67 CPLD.14 | ROM_32KB.15 49.53,44.45 52.07,41.91 60.96,41.91 v63.5,44.45 | ADDRESS_LATCH.5 69.85,38.1 v72.39,40.64 | v69.85,41.91 69.85,43.18 RAM_32KB.15 | v95.25,35.56 95.25,36.83 92.71,39.37 v88.9,39.37 | v85.09,29.21 v85.09,35.56 | v87.63,26.67 82.55,21.59 v57.15,21.59 | v6.35,58.42 11.43,53.34 21.59,53.34 26.67,48.26 30.48,48.26 v31.75,46.99 | v30.48,41.91 34.29,38.1 40.64,38.1 v41.91,39.37
AD4  (via drill 0.61)
  Top 0.305: BUFFER_2.9 22.86,13.97 24.13,15.24 24.13,22.86 | BUFFER_3.9 24.13,22.86 | BUFFER_1.9 22.86,30.48 24.13,29.21 24.13,22.86 | CPLD.18 86.36,25.4 78.74,33.02 78.74,40.64 77.47,41.91 | 77.47,41.91 73.66,45.72 69.85,45.72 RAM_32KB.16 | 77.47,41.91 v77.47,40.64 | v36.83,33.02 v34.29,33.02 | v41.91,30.48 45.72,34.29 53.34,34.29 57.15,38.1 64.77,38.1 ADDRESS_LATCH.6
  Bottom 0.305: ADDRESS_LATCH.6 67.31,43.18 66.04,44.45 | RAM_32KB.16 66.04,44.45 | ROM_32KB.16 48.26,46.99 52.07,43.18 57.15,43.18 62.23,48.26 66.04,44.45 | 8085.16 86.36,43.18 85.09,44.45 81.28,44.45 v77.47,40.64 | BUFFER_1.9 25.4,33.02 27.94,33.02 29.21,34.29 30.48,33.02 v34.29,33.02 | v36.83,33.02 39.37,30.48 v41.91,30.48
AD5  (via drill 0.61)
  Top 0.305: ROM_32KB.17 48.26,49.53 52.07,53.34 54.61,53.34 v58.42,49.53 | v95.25,39.37 96.52,40.64 v96.52,48.26 | v71.12,55.88 71.12,52.07 RAM_32KB.17 | 29.21,22.86 29.21,15.24 27.94,13.97 BUFFER_2.7 27.94,11.43 29.21,10.16 v29.21,8.89 | BUFFER_3.7 29.21,22.86 | BUFFER_1.7 27.94,30.48 29.21,29.21 29.21,22.86 | v87.63,29.21 90.17,29.21 CPLD.19 | v68.58,25.4 v54.61,11.43 | v55.88,46.99 55.88,43.18 v52.07,39.37
  Bottom 0.305: RAM_32KB.17 v58.42,49.53 v55.88,46.99 | 8085.17 93.98,40.64 v95.25,39.37 | v96.52,48.26 92.71,52.07 87.63,52.07 83.82,55.88 v71.12,55.88 | 68.58,26.67 68.58,29.21 64.77,33.02 ADDRESS_LATCH.7 60.96,39.37 v52.07,39.37 | 68.58,26.67 69.85,25.4 83.82,25.4 v87.63,29.21 | v29.21,8.89 31.75,8.89 34.29,6.35 34.29,3.81 36.83,1.27 44.45,1.27 v54.61,11.43 | 68.58,26.67 v68.58,25.4
AD6  (via drill 0.61)
  Top 0.305: BUFFER_1.5 33.02,39.37 v34.29,40.64 | v34.29,48.26 35.56,48.26 v36.83,49.53 | v87.63,46.99 88.9,45.72 88.9,40.64 8085.18 v87.63,34.29 | BUFFER_2.5 33.02,13.97 34.29,15.24 34.29,19.05 | 34.29,19.05 34.29,22.86 BUFFER_3.5 | v90.17,27.94 v87.63,27.94 86.36,29.21 v87.63,30.48 | v35.56,19.05 34.29,19.05 | v39.37,21.59 44.45,21.59 v50.8,27.94
  Bottom 0.305: v34.29,48.26 v34.29,40.64 | v36.83,49.53 36.83,50.8 38.1,52.07 ROM_32KB.18 45.72,52.07 46.99,50.8 54.61,50.8 55.88,52.07 RAM_32KB.18 69.85,52.07 72.39,49.53 85.09,49.53 v87.63,46.99 | ADDRESS_LATCH.8 62.23,33.02 66.04,29.21 66.04,26.67 67.31,25.4 | 67.31,25.4 68.58,24.13 83.82,24.13 v87.63,27.94 | v90.17,27.94 90.17,24.13 CPLD.20 | v35.56,19.05 36.83,19.05 v39.37,21.59 | 67.31,25.4 53.34,25.4 v50.8,27.94 | v87.63,30.48 v87.63,34.29
AD7  (via drill 0.61)
  Top 0.305: BUFFER_2.3 38.1,13.97 39.37,15.24 39.37,17.78 38.1,19.05 38.1,20.32 | BUFFER_3.3 38.1,20.32 | v38.1,30.48 BUFFER_1.3 v38.1,39.37 | ADDRESS_LATCH.9 44.45,20.32 38.1,20.32 | v96.52,22.86 95.25,24.13 95.25,31.75 8085.19 93.98,38.1 v93.98,48.26 | v58.42,54.61 57.15,55.88 52.07,55.88 50.8,54.61 ROM_32KB.19 43.81,53.98 43.18,53.98 42.55,53.34 42.55,51.44 41.91,50.8 41.27,50.8 40.64,50.16 40.64,49.53 40.01,48.9 38.73,48.9 36.83,46.99 v35.56,46.99
  Bottom 0.305: v38.1,30.48 36.83,29.21 36.83,25.4 BUFFER_3.3 | CPLD.22 92.71,21.59 95.25,21.59 v96.52,22.86 | v58.42,54.61 RAM_32KB.19 83.82,54.61 88.9,49.53 92.71,49.53 v93.98,48.26 | v38.1,39.37 35.56,41.91 v35.56,46.99
ALE  (via drill 0.61)
  Top 0.305: v57.15,22.86 ADDRESS_LATCH.11 | v78.74,22.86 95.25,6.35 96.52,6.35 99.06,3.81 104.14,3.81 v111.76,11.43
  Bottom 0.305: v78.74,22.86 v57.15,22.86 | v111.76,11.43 111.76,16.51 118.11,22.86 118.11,54.61 116.84,55.88 8085.30
D4  (via drill 0.61)
  Top 0.305: CPLD.33 100.33,11.43 100.33,17.78 105.41,22.86 105.41,24.13 114.3,24.13 119.38,29.21 v121.92,29.21
  Bottom 0.305: LCD.3 v121.92,29.21
D5  (via drill 0.61)
  Top 0.305: v102.87,24.13 102.87,29.21 105.41,31.75 121.92,31.75 LCD.4
  Bottom 0.305: CPLD.34 99.06,20.32 v102.87,24.13
D6  (via drill 0.61)
  Top 0.305: CPLD.35 102.87,11.43 102.87,19.05 105.41,21.59 111.76,21.59 113.03,22.86 114.3,22.86 119.38,27.94 v120.65,27.94
  Bottom 0.305: v120.65,27.94 120.65,33.02 LCD.5
D7  (via drill 0.61)
  Top 0.305: v109.22,33.02 118.11,33.02 LCD.6
  Bottom 0.305: CPLD.36 101.6,19.05 100.33,20.32 104.14,24.13 107.95,24.13 107.95,31.75 v109.22,33.02
EN
  Top 0.305: CPLD.38 104.14,15.24 105.41,16.51 110.49,16.51 114.3,20.32 SV2.6
GND  (via drill 0.61, 0.7)
  Top 0.61: C3.2 25.4,66.04 LED2.K 22.86,71.12 25.4,73.66 31.75,73.66 38.1,80.01 C9.2 38.1,81.28 39.37,82.55 60.96,82.55 C8.2 66.04,81.28 v67.31,80.01 | 16.51,77.47 19.05,77.47 1117-3.3.1 | v3.81,26.67 2.54,27.94 2.54,33.02 | 2.54,38.1 2.54,33.02 | JP3.1 2.54,38.1 | JP1.1 2.54,54.61 2.54,38.1 | 20.32,44.45 v20.32,41.91 BUFFER_1.10 17.78,33.02 17.78,26.67 BUFFER_3.10 17.78,21.59 v17.78,19.05 15.24,21.59 15.24,27.94 10.16,33.02 2.54,33.02 | 20.32,44.45 15.24,44.45 S1.3 13.97,44.45 10.16,48.26 10.16,52.07 R9.1 15.24,57.15 15.24,76.2 16.51,77.47 | 20.32,44.45 S1.4 | C6.2 53.34,31.75 ADDRESS_LATCH.10 | RAM_32KB.14 49.53,40.64 v49.53,36.83 | 8085.20 86.36,33.02 C4.2 80.01,34.29 ADDRESS_LATCH.1 80.01,40.64 R3.1 73.66,48.26 | 73.66,48.26 R4.1 R5.1 R7.1 R6.1 v71.12,68.58 | v59.69,46.99 60.96,45.72 64.77,45.72 67.31,48.26 73.66,48.26 | C1.2 80.01,78.74 C2.2 76.2,82.55 v69.85,82.55 | C10.2 113.03,85.09 R2.1 125.73,72.39 CON1.2 128.27,66.04 128.27,40.64 | C19.2 97.79,2.54 115.57,2.54 | 115.57,2.54 120.65,2.54 SV2.1 128.27,10.16 128.27,25.4 | 128.27,40.64 LCD.7 | 128.27,25.4 128.27,40.64 | 128.27,25.4 SV2.8 LCD.1 LCD.2 106.68,30.48 105.41,29.21 105.41,26.67 CPLD.10 | U$1.P$2 114.3,3.81 115.57,2.54 | v10.16,73.66 11.43,73.66 13.97,76.2 C16.- 16.51,77.47 | C5.2 48.9,10.16 v53.34,14.61 | C7.2 48.9,22.23 v55.24,28.57
  Bottom 0.61: C16.- C15.- | v3.81,26.67 JP2.1 | BUFFER_2.10 17.78,15.24 v17.78,19.05 | ROM_32KB.14 26.67,41.91 v20.32,41.91 | C3.2 22.86,60.96 16.51,54.61 R9.1 | v49.53,36.83 55.88,36.83 ADDRESS_LATCH.10 | RAM_32KB.14 57.15,44.45 v59.69,46.99 | C2.2 80.01,83.82 99.06,83.82 C10.2 | v71.12,68.58 74.93,72.39 77.47,72.39 80.01,74.93 C1.2 | v69.85,82.55 v67.31,80.01 | U$2.1 6,77.82 v10.16,73.66 | v53.34,14.61 53.34,15.24 C7.2 | C6.2 52.07,31.75 v55.24,28.57 | SV2.8 SV2.7 124.46,22.86 123.19,21.59 123.19,19.05 124.46,17.78 SV2.5
INA0  (via drill 0.61)
  Top 0.305: v45.72,35.56 53.34,35.56 57.15,39.37 67.31,39.37 v68.58,38.1 | v78.74,46.99 77.47,48.26 77.47,67.31 71.12,73.66 71.12,77.47 64.77,83.82 62.23,83.82 60.96,85.09 26.67,85.09 24.13,82.55 17.78,82.55 15.24,85.09 10.16,85.09 5.08,80.01 2.54,80.01 1.27,78.74 1.27,64.77 7.62,58.42 7.62,57.15 JP1.2
  Bottom 0.305: BUFFER_1.2 43.18,38.1 v45.72,35.56 | v68.58,38.1 72.39,41.91 74.93,41.91 78.74,45.72 v78.74,46.99
INA1  (via drill 0.61)
  Top 0.305: v41.91,31.75 44.45,34.29 44.45,39.37 v50.8,45.72 | v25.4,71.12 54.61,71.12 59.69,66.04 59.69,59.05 60.33,58.42 60.33,48.9 59.69,48.26 v59.05,48.26
  Bottom 0.305: BUFFER_1.4 39.37,31.75 v41.91,31.75 | v50.8,45.72 56.52,45.72 v59.05,48.26 | v25.4,71.12 25.4,68.58 16.51,59.69 6.35,59.69 5.08,58.42 5.08,54.61 JP1.4
INA2  (via drill 0.61)
  Top 0.305: BUFFER_1.6 30.48,36.83 26.67,40.64 26.67,43.18 25.4,44.45 24.13,44.45 21.59,46.99 13.97,46.99 v11.43,49.53
  Bottom 0.305: v11.43,49.53 8.89,49.53 7.62,50.8 JP1.6
INA3
  Bottom 0.305: BUFFER_1.8 17.78,43.18 11.43,43.18 JP1.8
INA4  (via drill 0.61)
  Top 0.305: v7.62,44.45 5.08,44.45 JP1.9
  Bottom 0.305: BUFFER_1.11 13.97,27.94 7.62,34.29 v7.62,44.45
INA5  (via drill 0.61)
  Top 0.305: BUFFER_1.13 25.4,31.75 v24.13,33.02 | v16.51,36.83 10.16,43.18 v5.08,43.18
  Bottom 0.305: v24.13,33.02 20.32,33.02 v16.51,36.83 | v5.08,43.18 5.08,46.99 JP1.7
INA6  (via drill 0.61)
  Top 0.305: v26.67,44.45 v29.21,41.91
  Bottom 0.305: BUFFER_1.15 35.56,33.02 34.29,34.29 34.29,36.83 v29.21,41.91 | v26.67,44.45 26.67,45.72 25.4,46.99 10.16,46.99 7.62,49.53 5.08,49.53 JP1.5
INA7  (via drill 0.61)
  Top 0.305: BUFFER_1.17 35.56,30.48 33.02,33.02 34.29,34.29 v34.29,39.37
  Bottom 0.305: v34.29,39.37 31.75,41.91 31.75,44.45 30.48,45.72 27.94,45.72 21.59,52.07 5.08,52.07 JP1.3
INB0
  Bottom 0.305: BUFFER_2.2 38.1,10.16 20.32,10.16 7.62,22.86 JP2.2
INB1  (via drill 0.61)
  Top 0.305: v35.56,7.62 BUFFER_2.4 | v44.45,8.89 52.07,16.51 55.88,16.51 66.04,26.67 66.04,29.21 v69.85,33.02 | v73.66,40.64 71.12,43.18 62.23,43.18 v55.88,49.53 | v40.01,50.8 38.73,49.53 38.1,49.53 36.83,50.8 v31.75,50.8 | v22.86,53.34 17.78,53.34 16.51,54.61 v16.51,68.58
  Bottom 0.305: v35.56,7.62 39.37,7.62 40.64,8.89 v44.45,8.89 | v69.85,33.02 71.12,34.29 71.12,38.1 v73.66,40.64 | v55.88,49.53 54.61,48.26 49.53,48.26 48.26,49.53 46.99,49.53 45.72,50.8 v40.01,50.8 | v31.75,50.8 25.4,50.8 v22.86,53.34 | v16.51,68.58 15.24,69.85 10.16,69.85 1.27,60.96 1.27,20.32 2.54,19.05 5.08,19.05 JP2.4
INB2  (via drill 0.61)
  Top 0.305: BUFFER_2.6 30.48,8.89 29.21,7.62 v16.51,7.62 | v8.89,7.62 5.08,11.43 5.08,16.51 JP2.6
  Bottom 0.305: v8.89,7.62 v16.51,7.62
INB3  (via drill 0.61)
  Top 0.305: v25.4,8.89 BUFFER_2.8
  Bottom 0.305: v25.4,8.89 17.78,8.89 11.43,15.24 JP2.8
INB4
  Bottom 0.305: BUFFER_2.11 10.16,5.08 3.81,11.43 JP2.9
INB5
  Bottom 0.305: BUFFER_2.13 22.86,7.62 17.78,7.62 11.43,13.97 5.08,13.97 JP2.7
INB6
  Bottom 0.305: BUFFER_2.15 26.67,1.27 12.7,1.27 1.27,12.7 1.27,16.51 2.54,17.78 JP2.5
INB7  (via drill 0.61)
  Top 0.305: v43.18,2.54 41.91,2.54 40.64,1.27 11.43,1.27 1.27,11.43 1.27,19.05 2.54,20.32 JP2.3
  Bottom 0.305: BUFFER_2.17 38.1,2.54 v43.18,2.54
INC0  (via drill 0.61)
  Top 0.305: BUFFER_3.2 40.64,25.4 39.37,26.67 39.37,31.75 41.91,34.29 41.91,38.1 39.37,40.64 35.56,40.64 34.29,41.91 v30.48,38.1 | v21.59,38.1 v24.13,40.64 | v8.89,38.1 7.62,39.37 JP3.2
  Bottom 0.305: v30.48,38.1 27.94,40.64 v24.13,40.64 | v8.89,38.1 v21.59,38.1
INC1  (via drill 0.61)
  Top 0.305: BUFFER_3.4 35.56,25.4 34.29,26.67 34.29,30.48 v33.02,31.75 | v16.51,35.56 7.62,35.56 JP3.4
  Bottom 0.305: v33.02,31.75 30.48,31.75 29.21,33.02 27.94,31.75 20.32,31.75 v16.51,35.56
INC2  (via drill 0.61)
  Top 0.305: BUFFER_3.6 30.48,25.4 31.75,26.67 31.75,29.21 v30.48,30.48 | JP3.6 v8.89,34.29
  Bottom 0.305: v30.48,30.48 29.21,31.75 27.94,30.48 12.7,30.48 v8.89,34.29
INC3  (via drill 0.61)
  Top 0.305: JP3.8 v8.89,31.75
  Bottom 0.305: BUFFER_3.8 22.86,21.59 19.05,21.59 v8.89,31.75
INC4  (via drill 0.61)
  Top 0.305: BUFFER_3.11 17.78,16.51 v16.51,15.24
  Bottom 0.305: v16.51,15.24 3.81,27.94 JP3.9
INC5
  Top 0.305: BUFFER_3.13 25.4,15.24 24.13,13.97 24.13,11.43 22.86,10.16 17.78,10.16 10.16,17.78 10.16,27.94 7.62,30.48 5.08,30.48 JP3.7
INC6
  Bottom 0.305: BUFFER_3.15 27.94,19.05 19.05,19.05 7.62,30.48 7.62,33.02 5.08,33.02 JP3.5
INC7  (via drill 0.61)
  Top 0.305: v33.02,21.59 v33.02,19.05 | v29.21,30.48 29.21,36.83 v27.94,38.1 | v24.13,38.1 22.86,38.1 21.59,36.83 21.59,34.29 v19.05,31.75 | v13.97,36.83 8.89,36.83 7.62,38.1 5.08,38.1 JP3.3
  Bottom 0.305: v33.02,19.05 BUFFER_3.17 | v33.02,21.59 30.48,21.59 29.21,22.86 v29.21,30.48 | v24.13,38.1 v27.94,38.1 | v13.97,36.83 v19.05,31.75
IO/NM  (via drill 0.61)
  Top 0.305: CPLD.1 107.95,19.05 110.49,19.05 v113.03,21.59 | v114.3,49.53 114.3,57.15 109.22,62.23 109.22,63.5 8085.34
  Bottom 0.305: v113.03,21.59 113.03,22.86 114.3,24.13 v114.3,49.53
N$1
  Top 0.305: C2.1 Q1.2 8085.1
N$2
  Top 0.305: C1.1 78.74,74.93 83.82,74.93 Q1.1 87.63,78.74 8085.2
N$3
  Top 0.305: 8085.35 109.22,71.12 R1.2
N$4
  Top 0.305: R2.2 8085.39
N$5
  Top 0.305: R3.2 88.9,52.07 88.9,55.88 8085.10
N$6
  Top 0.305: R4.2 83.82,53.34 8085.9
N$7
  Top 0.305: R5.2 88.9,63.5 8085.8
N$8
  Top 0.305: 8085.7 R6.2
N$9
  Bottom 0.305: R7.2 90.17,68.58 8085.6
N$10  (via drill 0.7 pad 3.81)
  other vias: 4.45,83.19
N$11  (via drill 0.7 pad 3.81)
  other vias: 127.64,83.19
N$12
  Top 0.305: C17.2 87.63,20.32 88.9,21.59 92.71,21.59 CPLD.23 95.25,19.05 95.25,11.43 CPLD.31 96.52,8.89 C18.2
N$13  (via drill 0.7 pad 3.81)
  other vias: 127.64,3.17
N$14  (via drill 0.7 pad 3.81)
  other vias: 3.81,3.17
N$15
  Top 0.305: R11.2 120.65,40.64 LCD.8
N$46
  Top 0.305: R9.2 12.7,67.31 LED1.K
N$47
  Top 0.61: U$1.P$3 SV2.3
N$51
  Top 0.305: R10.1 19.05,67.31 LED2.A
NA15  (via drill 0.61)
  Top 0.305: CPLD.26 92.71,16.51 92.71,19.05 90.17,19.05 v88.9,20.32 | v86.36,40.64 86.36,43.18 85.09,44.45 82.55,44.45 78.74,48.26 v78.74,66.04 | v71.12,66.04 67.31,66.04 66.04,64.77 66.04,59.69 RAM_32KB.20
  Bottom 0.305: v88.9,20.32 88.9,38.1 v86.36,40.64 | v78.74,66.04 80.01,67.31 78.74,68.58 73.66,68.58 v71.12,66.04
NIOR0  (via drill 0.61)
  Top 0.305: BUFFER_1.19 40.64,31.75 v41.91,33.02 43.18,34.29 BUFFER_1.1
  Bottom 0.305: CPLD.27 92.71,13.97 60.96,13.97 v41.91,33.02
NIOR1
  Top 0.305: BUFFER_2.19 40.64,10.16 BUFFER_2.1
  Bottom 0.305: BUFFER_2.1 CPLD.28
NIOR2  (via drill 0.61)
  Top 0.305: v58.42,13.97 v62.23,10.16 | BUFFER_3.1 v45.72,26.67
  Bottom 0.305: BUFFER_3.19 43.18,19.05 BUFFER_3.1 | v62.23,10.16 CPLD.29 | v45.72,26.67 v58.42,13.97
NMEMR  (via drill 0.61)
  Top 0.305: CPLD.24 86.36,17.78 81.28,22.86 81.28,29.21 v80.01,30.48 | v82.55,38.1 82.55,40.64 74.93,48.26 v74.93,59.69
  Bottom 0.305: ROM_32KB.22 50.8,62.23 52.07,63.5 67.31,63.5 RAM_32KB.22 71.12,59.69 v74.93,59.69 | v80.01,30.48 82.55,33.02 v82.55,38.1
NMEMW  (via drill 0.61)
  Top 0.305: RAM_32KB.27 76.2,67.31 v76.2,52.07 | v97.79,36.83 v100.33,39.37
  Bottom 0.305: v76.2,52.07 85.09,52.07 90.17,46.99 92.71,46.99 v100.33,39.37 | v97.79,36.83 97.79,21.59 CPLD.25
NRD  (via drill 0.61)
  Top 0.305: v113.03,50.8 113.03,54.61 8085.32
  Bottom 0.305: CPLD.2 113.03,24.13 v113.03,50.8
NRST  (via drill 0.61)
  Top 0.305: v77.47,39.37 R8.1 | v76.2,30.48 76.2,24.13 v88.9,11.43 | C3.1 25.4,53.34 21.59,49.53 S1.2 20.32,49.53 15.24,49.53 S1.1 | 100.33,71.12 93.98,71.12 92.71,72.39 76.2,72.39 72.39,76.2 72.39,77.47 v67.31,82.55 | 100.33,71.12 8085.36 | v85.09,41.91 85.09,40.64 86.36,39.37 87.63,40.64 87.63,43.18 85.09,45.72 82.55,45.72 80.01,48.26 80.01,60.96 83.82,64.77 93.98,64.77 100.33,71.12
  Bottom 0.305: v77.47,39.37 77.47,38.1 78.74,36.83 | 78.74,36.83 78.74,33.02 v76.2,30.48 | v88.9,11.43 105.41,11.43 CPLD.39 | v67.31,82.55 64.77,80.01 40.64,80.01 38.1,82.55 31.75,82.55 26.67,77.47 26.67,59.69 C3.1 | 78.74,36.83 83.82,41.91 v85.09,41.91
NWR  (via drill 0.61)
  Top 0.305: v104.14,17.78 CPLD.3 | 8085.31 v110.49,54.61
  Bottom 0.305: v104.14,17.78 105.41,16.51 110.49,16.51 115.57,21.59 115.57,49.53 v110.49,54.61
RS
  Top 0.305: CPLD.37 105.41,11.43 110.49,11.43 111.76,12.7 111.76,16.51 113.03,17.78 123.19,17.78 SV2.4
TCK  (via drill 0.61)
  Top 0.305: v93.98,35.56 96.52,38.1 97.79,38.1 99.06,39.37 99.06,64.77 v101.6,67.31
  Bottom 0.305: v93.98,35.56 CPLD.17 | v101.6,67.31 124.46,67.31 CON1.4
TDI  (via drill 0.61)
  Top 0.305: CPLD.15 97.79,26.67 97.79,24.13 v101.6,20.32 | v119.38,26.67 v111.76,19.05 | v121.92,52.07 121.92,59.69 CON1.7
  Bottom 0.305: v101.6,20.32 104.14,20.32 105.41,19.05 v111.76,19.05 | v119.38,26.67 119.38,49.53 v121.92,52.07
TDO  (via drill 0.61)
  Top 0.305: v82.55,16.51 82.55,12.7 93.98,1.27 121.92,1.27 129.54,8.89 129.54,67.31 v128.27,68.58
  Bottom 0.305: CPLD.30 95.25,13.97 95.25,16.51 v82.55,16.51 | v128.27,68.58 128.27,66.04 CON1.6
TMS  (via drill 0.61)
  Top 0.305: v95.25,33.02 96.52,34.29 109.22,34.29 123.19,48.26 CON1.9
  Bottom 0.305: CPLD.16 95.25,26.67 v95.25,33.02

### Text on the board
tNames: GND | +5V | Volume Detector | on 8085 | Rohan Seth : 108/EC/10 | Sarthak Gupta : 116/EC/10